# EAGLE design ioboard (EAGLE 9.6.2)
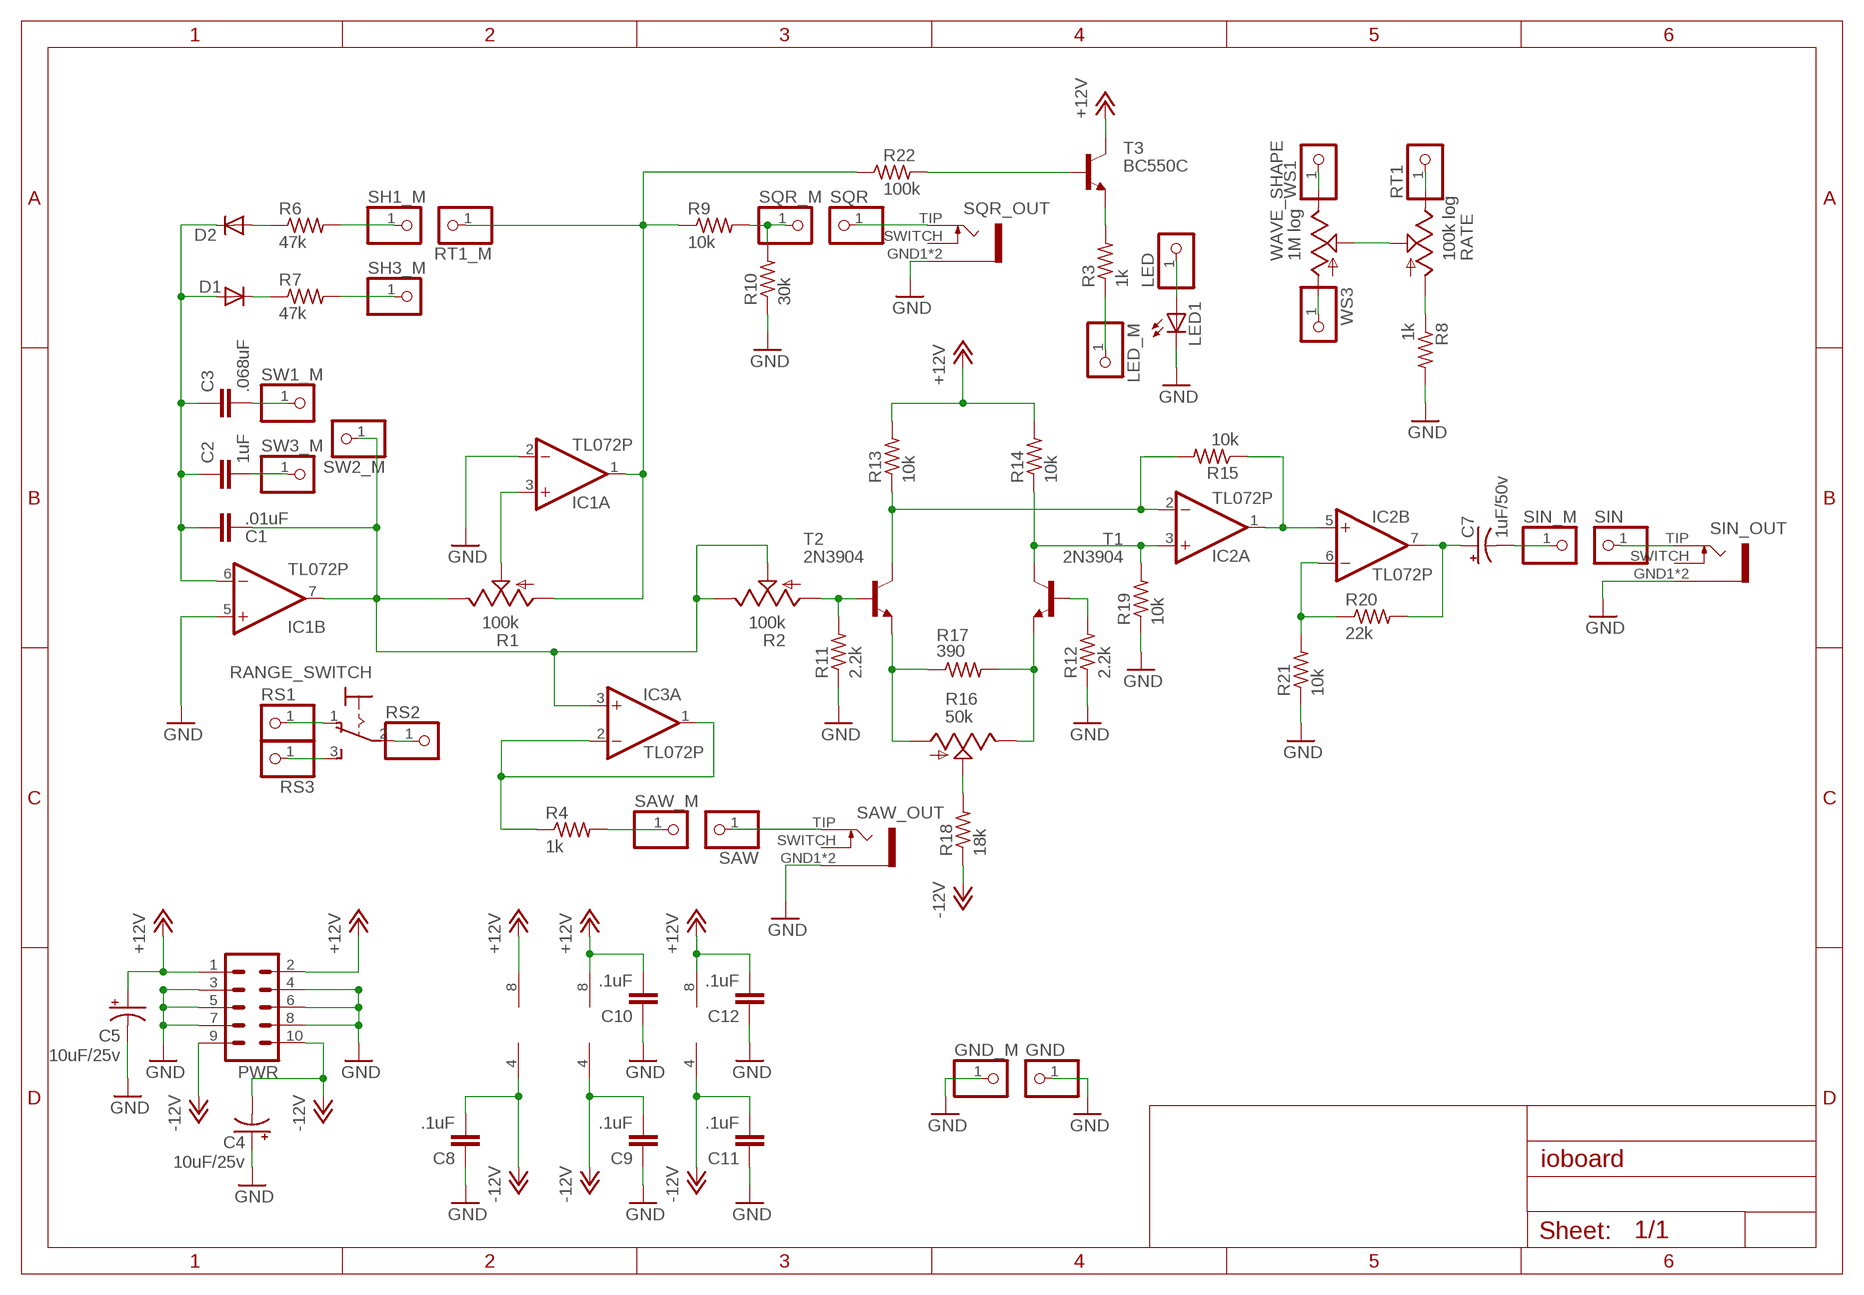
[diagram p0: schematic, sheet 1]

## Parts
C1  .01uF  C-EU050-025X075  [C050-025X075]
C2  1uF  C-EU050-025X075  [C050-025X075]
C3  .068uF  C-EU050-025X075  [C050-025X075]
C4  10uF/25v  CPOL-USE2.5-5  [E2,5-5]
C5  10uF/25v  CPOL-USE2.5-5  [E2,5-5]
C7  1uF/50v  CPOL-USE2.5-5  [E2,5-5]
C8  .1uF  C-EU025-024X044  [C025-024X044]
C9  .1uF  C-EU025-024X044  [C025-024X044]
C10  .1uF  C-EU025-024X044  [C025-024X044]
C11  .1uF  C-EU025-024X044  [C025-024X044]
C12  .1uF  C-EU025-024X044  [C025-024X044]
D1  1N4148DO35-7  [DO35-7]
D2  1N4148DO35-7  [DO35-7]
GND  PINHD-1X1  [1X01]
GND_M  PINHD-1X1  [1X01]
IC1  TL072P  [DIL08]
IC2  TL072P  [DIL08]
IC3  TL072P  [DIL08]
LED  PINHD-1X1  [1X01]
LED1  LED5MM  [LED5MM]
LED_M  PINHD-1X1  [1X01]
PWR  ML10  [ML10]
R1  100k  TRIM_US-RJ9W  [RJ9W]
R2  100k  TRIM_US-RJ9W  [RJ9W]
R3  1k  R-US_0207/10  [0207/10]
R4  1k  R-US_0207/2V  [0207/2V]
R6  47k  R-US_0207/10  [0207/10]
R7  47k  R-US_0207/10  [0207/10]
R8  1k  R-US_0207/10  [0207/10]
R9  10k  R-US_0207/10  [0207/10]
R10  30k  R-US_0207/10  [0207/10]
R11  2.2k  R-US_0207/10  [0207/10]
R12  2.2k  R-US_0207/10  [0207/10]
R13  10k  R-US_0207/10  [0207/10]
R14  10k  R-US_0207/2V  [0207/2V]
R15  10k  R-US_0207/2V  [0207/2V]
R16  50k  TRIM_US-RJ9W  [RJ9W]
R17  390  R-US_0207/10  [0207/10]
R18  18k  R-US_0207/10  [0207/10]
R19  10k  R-US_0207/2V  [0207/2V]
R20  22k  R-US_0207/2V  [0207/2V]
R21  10k  R-US_0207/2V  [0207/2V]
R22  100k  R-US_0207/10  [0207/10]
RANGE_SWITCH  M9040P  [M9040P]
RATE  100k log  ALPHA-9MMA  [EVUF]
RS1  PINHD-1X1  [1X01]
RS2  PINHD-1X1  [1X01]
RS3  PINHD-1X1  [1X01]
RT1  PINHD-1X1  [1X01]
RT1_M  PINHD-1X1  [1X01]
SAW  PINHD-1X1  [1X01]
SAW_M  PINHD-1X1  [1X01]
SAW_OUT  PJ301BMPJ301BM  [PJ301BM]
SH1_M  PINHD-1X1  [1X01]
SH3_M  PINHD-1X1  [1X01]
SIN  PINHD-1X1  [1X01]
SIN_M  PINHD-1X1  [1X01]
SIN_OUT  PJ301BMPJ301BM  [PJ301BM]
SQR  PINHD-1X1  [1X01]
SQR_M  PINHD-1X1  [1X01]
SQR_OUT  PJ301BMPJ301BM  [PJ301BM]
SW1_M  PINHD-1X1  [1X01]
SW2_M  PINHD-1X1  [1X01]
SW3_M  PINHD-1X1  [1X01]
T1  2N3904  [TO92]
T2  2N3904  [TO92]
T3  BC550C  BC550-NPN-TO92-CBE  [TO92-CBE]
WAVE_SHAPE  1M log  ALPHA-9MMA  [EVUF]
WS1  PINHD-1X1  [1X01]
WS3  PINHD-1X1  [1X01]

## Nets
+12V: C5.+ C10.2 C12.2 IC1.8(P:V+) IC2.8(P:V+) IC3.8(P:V+) PWR.1 PWR.2 R13.2 R14.2 T3.C
-12V: C4.- C8.2 C9.2 C11.2 IC1.4(P:V-) IC2.4(P:V-) IC3.4(P:V-) PWR.9 PWR.10 R18.1
GND: C4.+ C5.- C8.1 C9.1 C10.1 C11.1 C12.1 GND.1 GND_M.1 IC1.2(A:-IN) IC1.5(B:+IN) LED1.K(C) PWR.3 PWR.4 PWR.5 PWR.6 PWR.7 PWR.8 R8.2 R10.1 R11.1 R12.1 R19.1 R21.1 SAW_OUT.GND1 SAW_OUT.GND2 SIN_OUT.GND1 SIN_OUT.GND2 SQR_OUT.GND1 SQR_OUT.GND2
N$1: RATE.2(S) WAVE_SHAPE.2(S)
N$2: D2.A R6.1
N$3: D1.C R7.1
N$4: RATE.3(E) RT1.1
N$5: R7.2 SH3_M.1
N$6: C1.1 C2.1 C3.1 D1.A D2.C IC1.6(B:-IN)
N$7: C2.2 SW3_M.1
N$8: R8.1 RATE.1(A)
N$9: RANGE_SWITCH.2(P) RS2.1
N$10: IC1.3(A:+IN) R1.S
N$11: LED_M.1 R3.1
N$12: IC1.1(A:OUT) R1.A R9.1 R22.1 RT1_M.1
N$13: IC2.2(A:-IN) R13.1 R15.2 T2.1(C)
N$14: C1.2 IC1.7(B:OUT) IC3.3(A:+IN) R1.E R2.E R2.S SW2_M.1
N$15: R22.2 T3.B
N$16: R9.2 R10.2 SQR_M.1
N$17: R16.S R18.2
N$18: C7.+ IC2.7(B:OUT) R20.2
N$19: C7.- SIN_M.1
N$20: R2.A R11.2 T2.2(B)
N$21: R16.A R17.1 T2.3(E)
N$22: R16.E R17.2 T1.3(E)
N$23: LED1.A LED.1
N$24: R3.2 T3.E
N$25: R12.2 T1.2(B)
N$26: IC2.3(A:+IN) R14.1 R19.2 T1.1(C)
N$27: IC2.1(A:OUT) IC2.5(B:+IN) R15.1
N$28: IC2.6(B:-IN) R20.1 R21.2
N$29: SAW.1 SAW_OUT.TIP
N$30: SQR.1 SQR_OUT.TIP
N$31: SIN.1 SIN_OUT.TIP
N$32: WAVE_SHAPE.3(E) WS1.1
N$33: RANGE_SWITCH.3(S) RS3.1
N$34: C3.2 SW1_M.1
N$36: IC3.1(A:OUT) IC3.2(A:-IN) R4.1
N$37: WAVE_SHAPE.1(A) WS3.1
N$38: R4.2 SAW_M.1
SH1_M: R6.2 SH1_M.1
SLOW_IO: RANGE_SWITCH.1(O) RS1.1
Unconnected: IC3.5(B:+IN) IC3.6(B:-IN) IC3.7(B:OUT) SAW_OUT.SWITCH SIN_OUT.SWITCH SQR_OUT.SWITCH

## Library data of the parts
C1-C3 C8-C12 = resistor:C-EU: CAPACITOR, European symbol
C4 C5 C7 = resistor:CPOL-US: POLARIZED CAPACITOR, American symbol
D1 D2 = diode:1N4148: DIODE high speed (Philips)
GND GND_M LED LED_M RS1-RS3 RT1 RT1_M SAW SAW_M SH1_M SH3_M SIN SIN_M SQR SQR_M SW1_M SW2_M SW3_M WS1 WS3 = pinhead:PINHD-1X1: PIN HEADER
IC1-IC3 = TomW:TL072: OP AMP
LED1 = led:LED: LED OSRAM: - CHIPLED LG R971, LG N971, LY N971, LG Q971, LY Q971, LO R971, LY R971 LH N974, LH R974 LS Q976, LO Q976, LY Q976 LO Q996 - Hyper CHIPLED LW Q18S LB Q993, LB Q99A, LB R99A - SideLED LS A670, LO A670, LY A670, LG A670, LP A670 LB A673, LV A673, LT A673, LW A673 LH A674 LY A675 LS A676, LA A676, LO A676, LY A676, LW A676 LS A679, LY A679, LG A679 - Hyper Micro SIDELED® LS Y876, LA Y876, LO Y876, LY Y876 LT Y87S - SmartLED LW L88C, LW L88S LB L89C, LB L89S, LG L890 LS L89K, LO L89K, LY L89K LS L896, LA L896, LO L896, LY L896 - TOPLED LS T670, LO T670, LY T670, LG T670, LP T670 LSG T670, LSP T670, LSY T670, LOP T670, LYG T670 LG T671, LOG T671, LSG T671 LB T673, LV T673, LT T673, LW T673 LH T674 LS T676, LA T676, LO T676, LY T676, LB T676, LH T676, LSB T676, LW T676 LB T67C, LV T67C, LT T67C, LS T67K, LO T67K, LY T67K, LW E67C LS E67B, LA E67B, LO E67B, LY E67B, LB E67C, LV E67C, LT E67C LW T67C LS T679, LY T679, LG T679 LS T770, LO T770, LY T770, LG T770, LP T770 LB T773, LV T773, LT T773, LW T773 LH T774 LS E675, LA E675, LY E675, LS T675 LS T776, LA T776, LO T776, LY T776, LB T776 LHGB T686 LT T68C, LB T68C - Hyper Mini TOPLED® LB M676 - Mini TOPLED Santana® LG M470 LS M47K, LO M47K, LY M47K Source: http://www.osram.convergy.de LUXEON: - LUMILED® LXK2-PW12-R00, LXK2-PW12-S00, LXK2-PW14-U00, LXK2-PW14-V00 LXK2-PM12-R00, LXK2-PM12-S00, LXK2-PM14-U00 LXK2-PE12-Q00, LXK2-PE12-R00, LXK2-PE12-S00, LXK2-PE14-T00, LXK2-PE14-U00 LXK2-PB12-K00, LXK2-PB12-L00, LXK2-PB12-M00, LXK2-PB14-N00, LXK2-PB14-P00, LXK2-PB14-Q00 LXK2-PR12-L00, LXK2-PR12-M00, LXK2-PR14-Q00, LXK2-PR14-R00 LXK2-PD12-Q00, LXK2-PD12-R00, LXK2-PD12-S00 LXK2-PH12-R00, LXK2-PH12-S00 LXK2-PL12-P00, LXK2-PL12-Q00, LXK2-PL12-R00 Source: www.luxeon.com KINGBRIGHT: KA-3528ASYC Source: www.kingbright.com
PWR = con-ml:ML10: HARTING; OC_FARNELL: unknown; OC_NEWARK: unknown
R1 R2 R16 = pot:TRIM_US-: POTENTIOMETER
R3 R4 R6-R15 R17-R22 = resistor:R-US_: RESISTOR, American symbol
RANGE_SWITCH = switch:M9040P: TOGGLE SWITCH Marquardt
RATE WAVE_SHAPE = TomW:ALPHA-9MM: 9 mm Square Rotary Potentiometers Source: Panasonic
SAW_OUT SIN_OUT SQR_OUT = gerbster:PJ301BM
T1 T2 = transistor:2N3904: NPN TRANSISTOR
T3 = transistor:*-NPN-: NPN Transistror BF959 corrected 2008.03.06

## Board
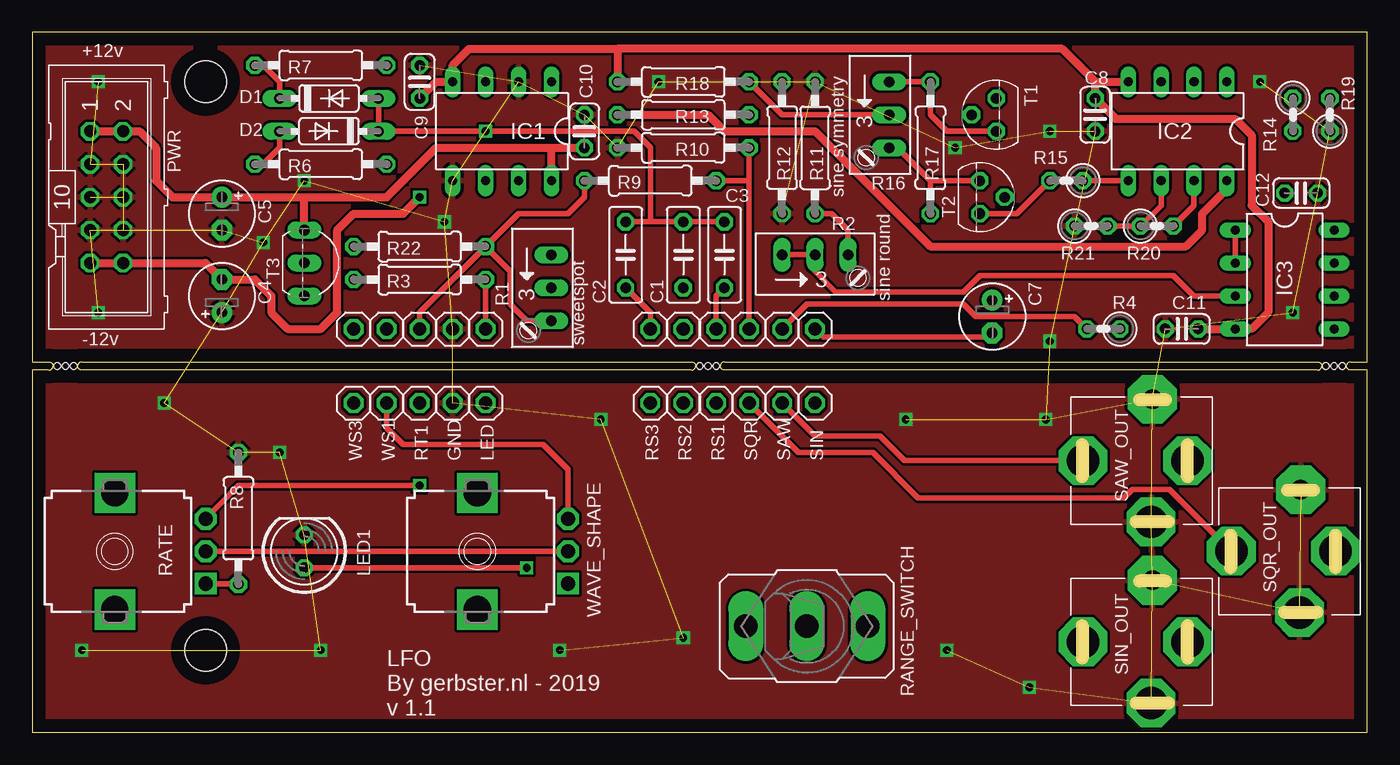
[diagram p1: board, top side]
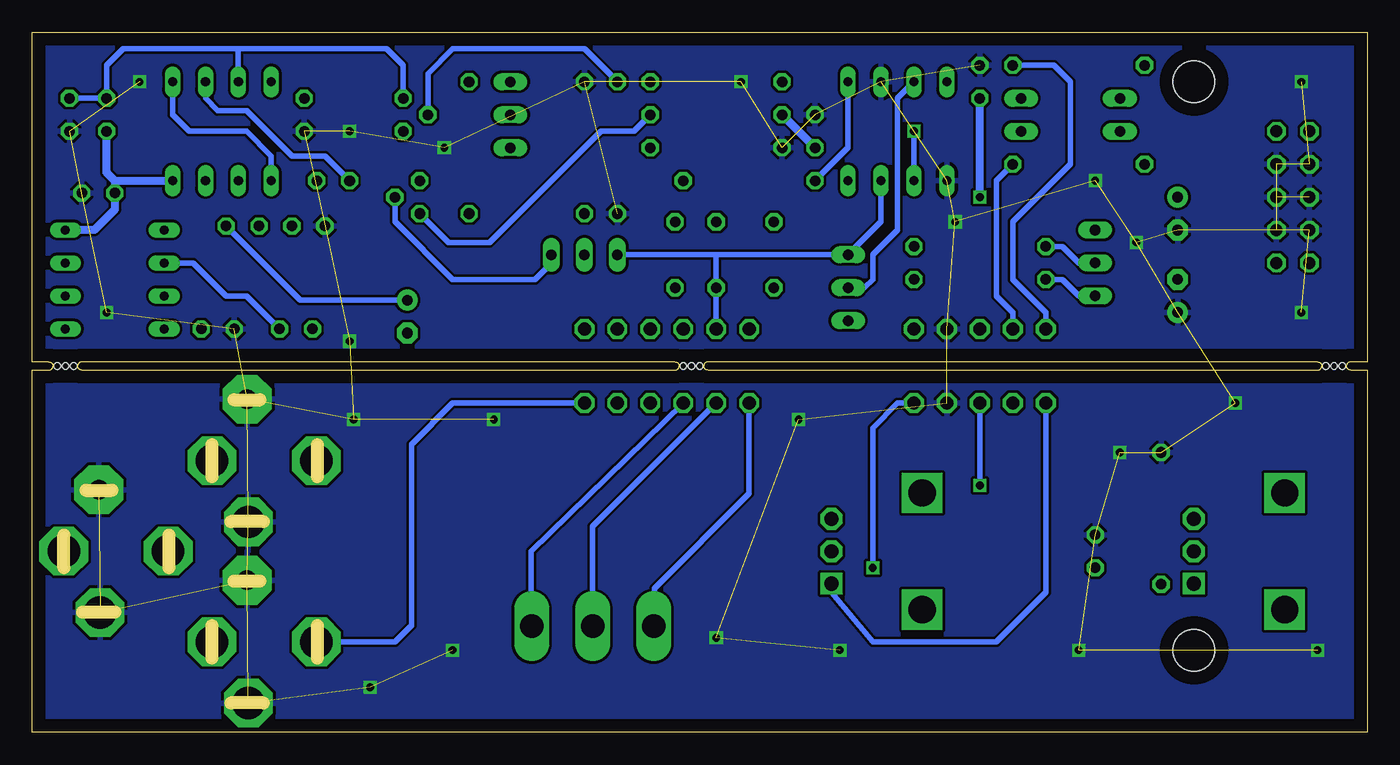
[diagram p2: board, bottom side, seen from below]

Size 102.87 x 53.98 mm. Coordinates in mm from the lower left corner, seen from the top.
Outline: 102.87,0 102.87,27.94 101.6,27.94 arc-90 101.28,28.26 arc-90 101.6,28.57 102.87,28.57 102.87,53.98 0,53.98 0,28.57 1.27,28.57 arc-90 1.59,28.26 arc-90 1.27,27.94 0,27.94 0,0 102.87,0
Outline: 99.06,27.94 53.34,27.94 arc-90 53.02,28.26 arc-90 53.34,28.57 99.06,28.57 arc-90 99.38,28.26 arc-90 99.06,27.94
Outline: 50.8,27.94 3.81,27.94 arc-90 3.49,28.26 arc-90 3.81,28.57 50.8,28.57 arc-90 51.12,28.26 arc-90 50.8,27.94
Copper layers (1*16): Top 0.035mm / dielectric 1.5mm / Bottom 0.035mm
Design rules "default": minimum track width 10mil, minimum drill 24mil, track to track 8mil, track to pad 8mil, pad to pad 8mil, via to via 8mil, smd to smd 8mil, copper to edge 40mil, drill to drill 8mil, minimum pad ring 10mil, minimum via ring 8mil, stop-mask expansion 4mil, vias tented up to drill 0mil, thermal gap 10mil
Holes 3.21 mm at 13.34,50.16 13.34,6.35
Holes 0.5 mm at 99.69,28.26 100.33,28.26 100.97,28.26 1.91,28.26 2.54,28.26 3.17,28.26 52.07,28.26 52.7,28.26 51.44,28.26 1.91,28.26

### Footprints (pad centres in the part's own frame; a part is rotated, then mirrored left to right if it is on the bottom)
C050-025X075 = drill 0.813 octagon: 1 -2.54,0; 2 2.54,0
E2,5-5 = drill 0.813 pad 1.6: + -1.27,0 | drill 0.813 pad 1.6 octagon: - 1.27,0
C025-024X044 = drill 0.813 octagon: 1 -1.27,0; 2 1.27,0
DO35-7 = drill 0.813 long: A 3.81,0; C -3.81,0
1X01 = drill 1.016 octagon: 1 0,0
DIL08 = drill 0.7 long: 1 -3.81,-3.81; 2 -1.27,-3.81; 3 1.27,-3.81; 4 3.81,-3.81; 5 3.81,3.81; 6 1.27,3.81; 7 -1.27,3.81; 8 -3.81,3.81
LED5MM = drill 0.813 octagon: A -1.27,0; K 1.27,0
ML10 = drill 0.914 octagon: 1 -5.08,-1.27; 2 -5.08,1.27; 3 -2.54,-1.27; 4 -2.54,1.27; 5 0,-1.27; 6 0,1.27; 7 2.54,-1.27; 8 2.54,1.27; 9 5.08,-1.27; 10 5.08,1.27
RJ9W = drill 0.813 long: A 2.54,0.635; E -2.54,0.635; S 0,0.635
0207/10 = drill 0.813 octagon: 1 -5.08,0; 2 5.08,0
0207/2V = drill 0.813 octagon: 1 -1.27,0; 2 1.27,0
M9040P = drill 1.803 long: 1 0,4.699; 2 0,0; 3 0,-4.699
EVUF = drill 1.1 pad 1.676 square: 1 -2.5,-7 | drill 1.1 pad 1.676 octagon: 2 0,-7; 3 2.5,-7 | drill 2.1 pad 2.8 square: M1 4.5,0; M2 -4.5,0
PJ301BM = drill 2.5 pad 3.75 octagon: GND1 -4.719,-0.5; SWITCH 0,-3.3; TIP 0,4.746 | drill 1.5 pad 3.75 octagon: GND2 4.746,-0.6
TO92 = drill 0.813 octagon: 1 1.27,0; 2 0,1.905; 3 -1.27,0
TO92-CBE = drill 0.813 long: B 0,0; C -2.54,0; E 2.54,0

### Placement (x,y rotation side)
C1  50.16,36.83 270 top
C2  45.72,36.83 270 top
C3  53.34,36.83 270 top
C4  14.61,33.66 90 top
C5  14.61,40.01 270 top
C7  73.98,32.07 270 top
C8  81.92,47.62 90 top
C9  29.84,50.16 270 top
C10  42.55,46.35 270 top
C11  88.58,31.11 0 top
C12  97.79,41.59 180 top
D1  22.86,48.9 0 top
D2  22.86,46.35 180 top
GND  32.38,25.4 90 top
GND_M  32.38,31.11 90 top
IC1  36.2,46.35 180 top
IC2  88.27,46.35 180 top
IC3  96.52,34.92 270 top
LED  34.92,25.4 90 top
LED1  20.95,13.97 90 top
LED_M  34.92,31.11 90 top
PWR  5.71,41.27 270 top
R1  39.37,34.29 270 top
R2  60.33,36.2 0 top
R3  29.84,34.92 180 top
R4  82.55,31.11 180 top
R6  22.23,43.81 0 top
R7  22.23,51.44 0 top
R8  15.88,16.51 90 top
R9  47.62,42.55 0 top
R10  50.16,45.09 0 top
R11  60.33,45.09 270 top
R12  57.78,45.09 90 top
R13  50.16,47.62 180 top
R14  97.16,47.62 270 top
R15  79.69,42.55 180 top
R16  65.41,47.62 270 top
R17  69.22,45.09 90 top
R18  50.16,50.16 0 top
R19  100.01,47.62 90 top
R20  86.68,39.05 0 top
R21  81.6,39.05 0 top
R22  29.84,37.47 180 top
RANGE_SWITCH  59.69,8.19 270 top
RATE  6.35,13.97 90 top
RS1  52.7,25.4 90 top
RS2  50.16,25.4 90 top
RS3  47.62,25.4 90 top
RT1  29.84,25.4 90 top
RT1_M  29.84,31.11 90 top
SAW  57.78,25.4 90 top
SAW_M  57.78,31.11 90 top
SAW_OUT  85.72,20.95 90 top
SH1_M  27.3,31.11 90 top
SH3_M  24.77,31.11 90 top
SIN  60.33,25.4 90 top
SIN_M  60.33,31.11 90 top
SIN_OUT  85.72,6.99 90 top
SQR  55.24,25.4 90 top
SQR_M  55.24,31.11 90 top
SQR_OUT  97.16,13.97 90 top
SW1_M  52.7,31.11 90 top
SW2_M  50.16,31.11 90 top
SW3_M  47.62,31.11 90 top
T1  74.3,47.62 90 top
T2  73.03,41.27 270 top
T3  20.95,36.2 270 top
WAVE_SHAPE  34.29,13.97 90 top
WS1  27.3,25.4 90 top
WS3  24.77,25.4 90 top

### Tracks (layer width: path | path; a pad name or v marks a point on that pad's centre or on a via)
+12V
  Top 0.61: PWR.1 PWR.2 8.26,46.35 9.53,45.09 9.53,42.55 10.79,41.27 C5.+ 20.95,41.27 | T3.C 20.95,41.27 | 20.95,41.27 27.3,41.27 31.11,45.09 40.01,45.09 | IC1.8 40.01,45.09 | 40.01,45.09 C10.2 | R13.2 52.07,47.62 53.34,46.35 60.33,46.35 69.22,37.47 88.9,37.47 90.17,38.73 90.17,40.01 92.08,41.91 IC2.8
  Bottom 0.61: 96.52,42.55 IC2.8 | C10.2 R13.2 | 96.52,42.55 C12.2 96.52,40.32 98.11,38.73 IC3.8 | 96.52,42.55 97.16,43.18 R14.2
-12V  (via drill 0.6)
  Top 0.61: PWR.9 PWR.10 13.34,36.2 C4.- 17.14,34.92 18.41,33.66 18.41,32.38 19.68,31.11 22.23,31.11 23.5,32.38 23.5,38.73 24.77,40.01 28.57,40.01 v29.84,41.27 | 81.92,50.16 IC2.4 | 81.92,50.16 C8.2 83.5,47.31 92.71,47.31 93.98,46.04 93.98,40.64 95.25,39.37 95.25,32.38 93.98,31.11 IC3.4 C11.2 | 81.92,50.16 79.38,52.7 45.09,52.7 | C9.2 31.11,50.16 IC1.4 32.38,51.44 33.66,52.7 45.09,52.7 | 45.09,52.7 R18.1
  Bottom 0.61: v29.84,41.27 C9.2
GND  (via drill 0.6)  (51 unrouted)
  other vias: 3.81,6.35 10.16,25.4 22.23,6.35 19.05,21.59 40.64,6.35 43.81,24.13 50.16,7.3 70.48,6.35 67.31,24.13 76.83,3.49 78.11,24.13 97.16,32.38 94.61,50.16 78.42,46.35 78.42,30.16 71.12,45.09 48.26,50.16 20.95,42.55 31.75,39.37 17.78,37.78 5.08,32.38 5.08,50.16
  pour Bottom: 0,28.57 102.87,28.57 102.87,53.98 0,53.98
  pour Top: 0,28.57 102.87,28.57 102.87,53.98 0,53.98
  pour Top: 0,0 102.87,0 102.87,27.94 0,27.94
  pour Bottom: 0,0 102.87,0 102.87,27.94 0,27.94
N$1
  Top 0.406: RATE.2 WAVE_SHAPE.2
N$2
  Top 0.406: R6.1 17.78,43.81 19.05,45.09 D2.A
N$3
  Top 0.406: D1.C 19.05,50.16 17.78,51.44 R7.1
N$4  (via drill 0.6)
  Top 0.406: RATE.3 13.34,16.47 15.88,19.05 v29.84,19.05
  Bottom 0.406: v29.84,19.05 RT1.1
N$5
  Bottom 0.406: R7.2 24.13,51.44 22.86,50.16 22.86,43.81 27.3,39.37 27.3,34.92 24.77,32.38 SH3_M.1
N$6  (via drill 0.6)
  Top 0.406: D1.A D2.C v34.92,46.35 46.35,46.35 47.62,45.09 47.62,39.37 | C3.1 C1.1 47.62,39.37 | C2.1 47.62,39.37
  Bottom 0.406: v34.92,46.35 IC1.6
N$7
  Top 0.406: C2.2 47.62,32.38 SW3_M.1
N$8
  Top 0.406: RATE.1 15.88,11.47 R8.1
N$9
  Bottom 0.406: RS2.1 59.69,15.88 RANGE_SWITCH.2
N$10
  Bottom 0.406: IC1.3 36.2,48.9 36.2,38.73 38.1,36.83 38.1,34.92 38.73,34.29 R1.S
N$11
  Top 0.406: LED_M.1 R3.1
N$12
  Top 0.406: RT1_M.1 29.84,32.38 R22.1 | R22.1 37.47,40.01 41.27,40.01 42.55,41.27 R9.1 | R22.1 36.83,35.56 36.83,33.02 38.1,31.75 R1.A
  Bottom 0.406: IC1.1 40.01,45.09 R9.1
N$13
  Top 0.406: T2.1 75.88,40.01 R15.2
  Bottom 0.406: R13.1 56.52,46.35 59.05,46.35 67.63,37.78 70.8,37.78 T2.1 | IC2.2 89.53,48.9 88.58,47.94 86.36,47.94 82.87,44.45 80.33,44.45 R15.2
N$14
  Top 0.406: R2.E R2.S 60.33,35.56 61.91,33.97 71.75,33.97 73.03,35.24 87.95,35.24 89.53,33.66 IC3.3
  Bottom 0.406: SW2_M.1 C1.2 50.16,36.83 | IC1.7 37.47,39.37 R1.E 50.16,36.83 | R2.E 50.16,36.83
N$15
  Bottom 0.406: T3.B 22.23,36.2 23.5,37.47 R22.2
N$16
  Top 0.406: R9.2 55.24,42.55 | R10.2 55.24,42.55 | 55.24,42.55 SQR_M.1
N$17
  Top 0.406: R18.2 57.78,47.62 R16.S
N$18
  Top 0.406: R20.2 89.53,40.64 IC2.7
  Bottom 0.406: C7.+ 82.23,33.34 R20.2
N$19
  Top 0.406: SIN_M.1 60.96,30.48 73.66,30.48 C7.-
N$20
  Top 0.406: R11.2 61.59,40.01 62.87,38.73 R2.A
  Bottom 0.406: R2.A 62.87,36.2 64.14,34.92 70.48,34.92 74.93,39.37 T2.2
N$21
  Top 0.406: R16.A 66.67,45.09 69.22,42.55 | 69.22,42.55 T2.3 | R17.1 69.22,42.55
N$22
  Top 0.406: T1.3 70.48,46.35 69.22,47.62 R17.2 R16.E
N$23  (via drill 0.6)
  Top 0.406: LED1.A v38.1,12.7
  Bottom 0.406: v38.1,12.7 38.1,23.5 36.2,25.4 LED.1
N$24
  Bottom 0.406: T3.E 22.23,33.66 23.5,34.92 R3.2
N$25
  Bottom 0.406: R12.2 60.33,52.7 70.48,52.7 72.39,50.8 T1.2
N$26
  Bottom 0.406: R19.2 R14.1 97.16,51.44 95.89,52.7 87,52.7 | IC2.3 87,52.7 | T1.1 74.3,51.44 75.56,52.7 87,52.7
N$27
  Top 0.406: R15.1 IC2.5
  Bottom 0.406: IC2.1 92.08,47.62 90.81,46.35 86.36,46.35 84.45,44.45 IC2.5
N$28
  Top 0.406: R21.2 R20.1 87,40.64 IC2.6
N$29
  Top 0.406: SAW_OUT.TIP 67.21,20.95 65.3,22.86 60.33,22.86 SAW.1
N$30
  Top 0.406: SQR.1 59.05,21.59 64.77,21.59 68.26,18.1 84.14,18.1 84.77,18.73 87.63,18.73 SQR_OUT.TIP
N$31
  Bottom 0.406: SIN.1 70.48,25.4 73.66,22.23 73.66,8.26 74.93,6.99 SIN_OUT.TIP
N$32
  Top 0.406: WS1.1 27.3,23.5 28.57,22.23 39.37,22.23 41.27,20.28 WAVE_SHAPE.3
N$33
  Bottom 0.406: RANGE_SWITCH.3 54.93,11.11 47.62,18.41 RS3.1
N$34
  Top 0.406: SW1_M.1 52.7,33.66 C3.2
N$36
  Top 0.406: IC3.1 IC3.2
  Bottom 0.406: R4.1 86.36,33.66 87.95,33.66 90.49,36.2 IC3.2
N$37
  Bottom 0.406: WS3.1 24.77,10.79 28.57,6.99 38.1,6.99 41.27,10.79 41.27,10.84 WAVE_SHAPE.1
N$38
  Top 0.406: SAW_M.1 59.69,33.02 71.75,33.02 72.71,32.07 80.33,32.07 R4.2
SH1_M
  Bottom 0.406: R6.2 28.57,42.55 28.57,33.66 27.3,32.38 SH1_M.1
SLOW_IO
  Bottom 0.406: RS1.1 64.45,13.97 64.45,8.26 RANGE_SWITCH.1

### Text on the board
tNames: +12v | sine symmetry | sine round | -12v | sweetspot | LFO | By gerbster.nl - 2019 | v 1.1